# Altium schematic sheet hud_v300_MCU.SchDoc
size A4; SheetNumber: 3; SheetTotal: 6
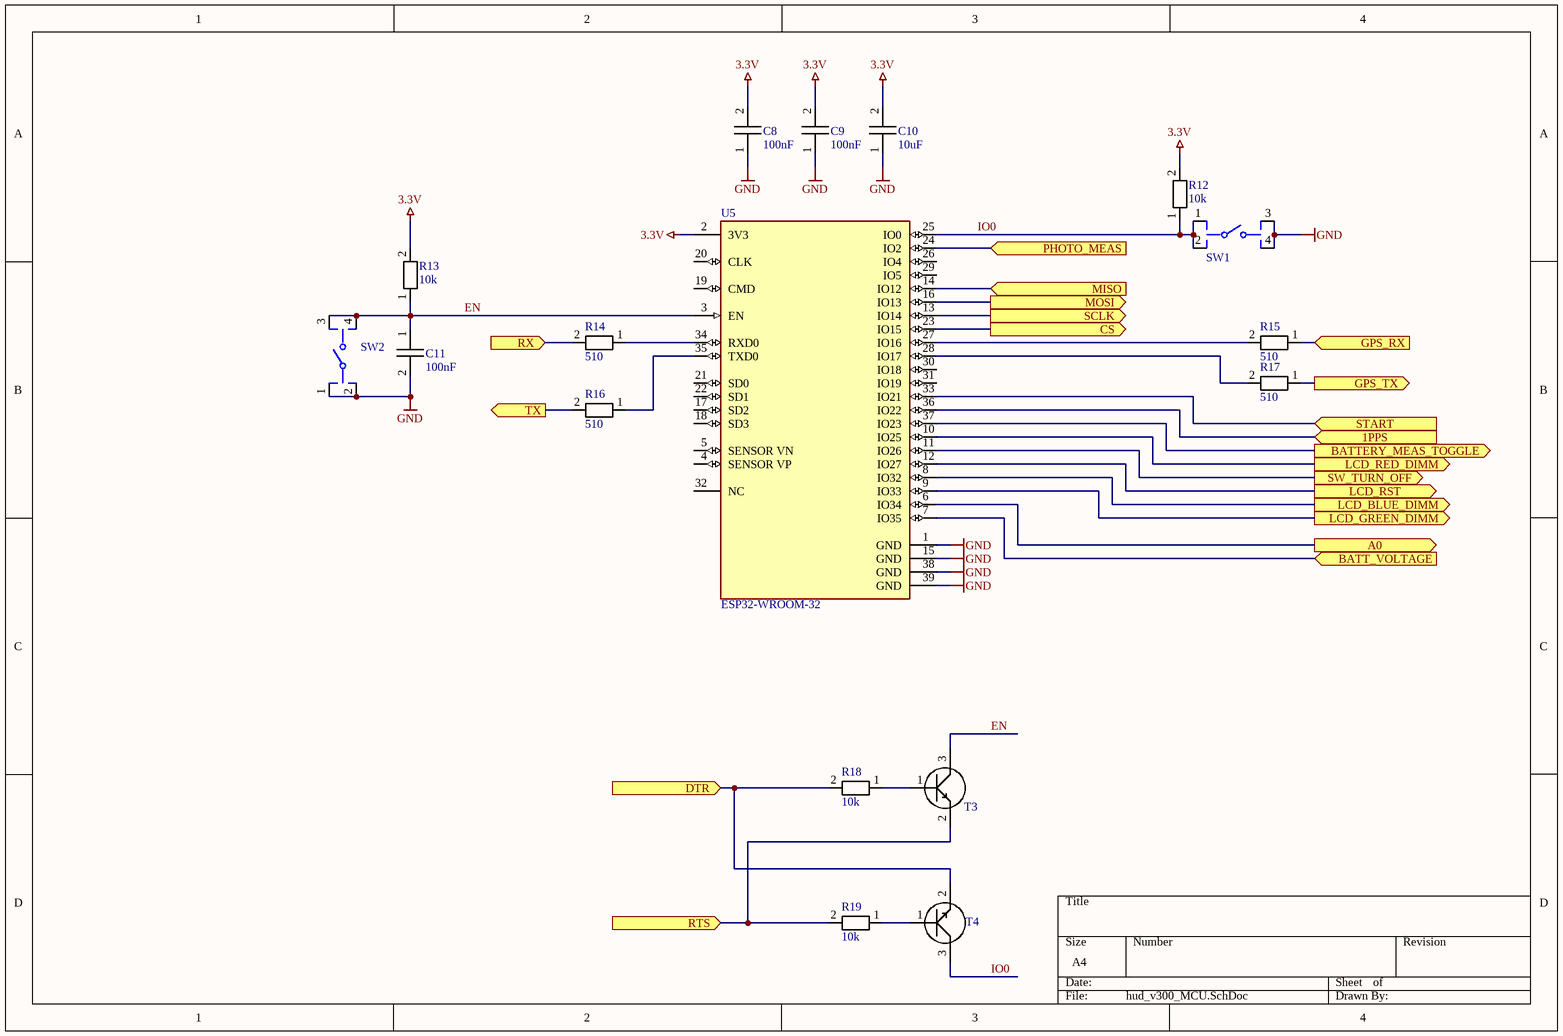
[diagram p0: hud_v300_MCU.SchDoc]

## Parts
C8  100nF  [0805_C]
C9  100nF  [0805_C]
C10  10uF  [1210_C]
C11  100nF  [0805_C]
R12  10k  [0805]
R13  10k  [0805]
R14  510  [0805]
R15  510  [0805]
R16  510  [0805]
R17  510  [0805]
R18  10k  [0805]
R19  10k  [0805]
SW1  Switch_C&K_KSC241JLFS_eec  [C&K_KSC241JLFS]  (value not drawn)
SW2  Switch_C&K_KSC241JLFS_eec  [C&K_KSC241JLFS]  (value not drawn)
T3  BC848*  [SOT23]  (value not drawn)
T4  BC848*  [SOT23]  (value not drawn)
U5  ESP32-WROOM-32  [FP-ESP32-WROOM-32-MFG]

## Ports
1PPS (in, see hud_v300_MAIN[3B]), A0 (out, see hud_v300_MAIN[3C], hud_v300_DISP[2D]), BATT_VOLTAGE (in, see hud_v300_MAIN[3A], hud_v300_PWR[3C]), BATTERY_MEAS_TOGGLE (out, see hud_v300_MAIN[3B], hud_v300_PWR[3C]), CS (out, see hud_v300_MAIN[3C]), DTR (in, see hud_v300_MAIN[3B], hud_v300_CONN[4B]), GPS_RX (in, see hud_v300_MAIN[3B]), GPS_TX (out, see hud_v300_MAIN[3B]), LCD_BLUE_DIMM (out, see hud_v300_MAIN[3D]), LCD_GREEN_DIMM (out, see hud_v300_MAIN[3C]), LCD_RED_DIMM (out, see hud_v300_MAIN[3C]), LCD_RST (out, see hud_v300_MAIN[3C], hud_v300_DISP[2D]), MISO (in, see hud_v300_MAIN[3C]), MOSI (out, see hud_v300_MAIN[3C], hud_v300_DISP[2D]), PHOTO_MEAS (in, see hud_v300_MAIN[3B]), RTS (in, see hud_v300_MAIN[3B], hud_v300_CONN[4B]), RX (in, see hud_v300_MAIN[3B]), SCLK (out, see hud_v300_MAIN[3C], hud_v300_DISP[2D]), START (in, see hud_v300_MAIN[3B], hud_v300_CONN[3C]), SW_TURN_OFF (out, see hud_v300_MAIN[3B], hud_v300_PWR[2D]), TX (out, see hud_v300_MAIN[3B])

## Nets
3.3V: C8.2 C9.2 C10.2 R12.2 R13.2 U5.2(3V3)
GND: C8.1 C9.1 C10.1 C11.2 SW1.3 SW1.4 SW2.1 SW2.2 U5.1(GND) U5.15(GND) U5.38(GND) U5.39(GND)
1PPS: U5.36(IO22) ; port 1PPS
A0: U5.6(IO34) ; port A0
BATT_VOLTAGE: U5.7(IO35) ; port BATT_VOLTAGE
BATTERY_MEAS_TOGGLE: U5.37(IO23) ; port BATTERY_MEAS_TOGGLE
CS: U5.23(IO15) ; port CS
DTR: R18.2 T4.2 ; port DTR
EN: C11.1 R13.1 SW2.3 SW2.4 T3.3 U5.3(EN)
GPS_RX: R15.1 ; port GPS_RX
GPS_TX: R17.1 ; port GPS_TX
IO0: R12.1 SW1.1 SW1.2 T4.3 U5.25(IO0)
LCD_BLUE_DIMM: U5.8(IO32) ; port LCD_BLUE_DIMM
LCD_GREEN_DIMM: U5.9(IO33) ; port LCD_GREEN_DIMM
LCD_RED_DIMM: U5.10(IO25) ; port LCD_RED_DIMM
LCD_RST: U5.12(IO27) ; port LCD_RST
MISO: U5.14(IO12) ; port MISO
MOSI: U5.16(IO13) ; port MOSI
PHOTO_MEAS: U5.24(IO2) ; port PHOTO_MEAS
RTS: R19.2 T3.2 ; port RTS
RX: R14.2 ; port RX
SCLK: U5.13(IO14) ; port SCLK
START: U5.33(IO21) ; port START
SW_TURN_OFF: U5.11(IO26) ; port SW_TURN_OFF
TX: R16.2 ; port TX
NetR14_1: R14.1 U5.34(RXD0)
NetR15_2: R15.2 U5.27(IO16)
NetR16_1: R16.1 U5.35(TXD0)
NetR17_2: R17.2 U5.28(IO17)
NetR18_1: R18.1 T3.1
NetR19_1: R19.1 T4.1

Not connected (* = marked no-connect by the designer): U5 4(SENSOR_VP) 5(SENSOR_VN) 17(SD2) 18(SD3) 19(CMD) 20(CLK) 21(SD0) 22(SD1) 26(IO4) 29(IO5) 30(IO18) 31(IO19) 32(NC)

## Library data of the parts
C8-C11 = CAPACITOR
R12 R13 R18 R19 = RESISTOR: Parameter 1: 10k
R14-R17 = RESISTOR: Parameter 1: 10k
SW1 SW2 = Switch_C&K_KSC241JLFS_eec: SWITCH TACTILE SPST-NO 0.05A 32V; Manufacturer: C&K; Part Number: KSC241JLFS; helpURL: https://upverter.com/upn/revision/9eb490e79e988993/; ComponentLink2Description: Datasheet; Temperature: -40°C to +85°C; Package: SMT_SW_6MM2_6MM2; Supplier 2: Mouser; Supplier 1: Digi-Key; ComponentLink1URL: https://upverter.com/upn/revision/9eb490e79e988993/; Supplier Part Number 2: 611-KSC241J-LFS; Supplier Part Number 1: 401-1762-1-ND; ComponentLink1Description: Upverter; ComponentLink2URL: http://www.ckswitches.com/media/1459/ksc.pdf; RoHS: TRUE; Mouser Part Number: 611-KSC241J-LFS; Digikey Description: SWITCH TACTILE SPST-NO 0.05A 32V; Digikey Part Number: 401-1762-1-ND; Lead Free: yes; Temperature Range Low: -40°C; Temperature Range High: +85°C
T3 T4 = TRANSISTOR_NPN
U5 = ESP32-WROOM-32: IC RF TXRX+MCU BLUETOOTH 48VFQFN